# EAGLE schematic AVRProg (EAGLE 6.2)
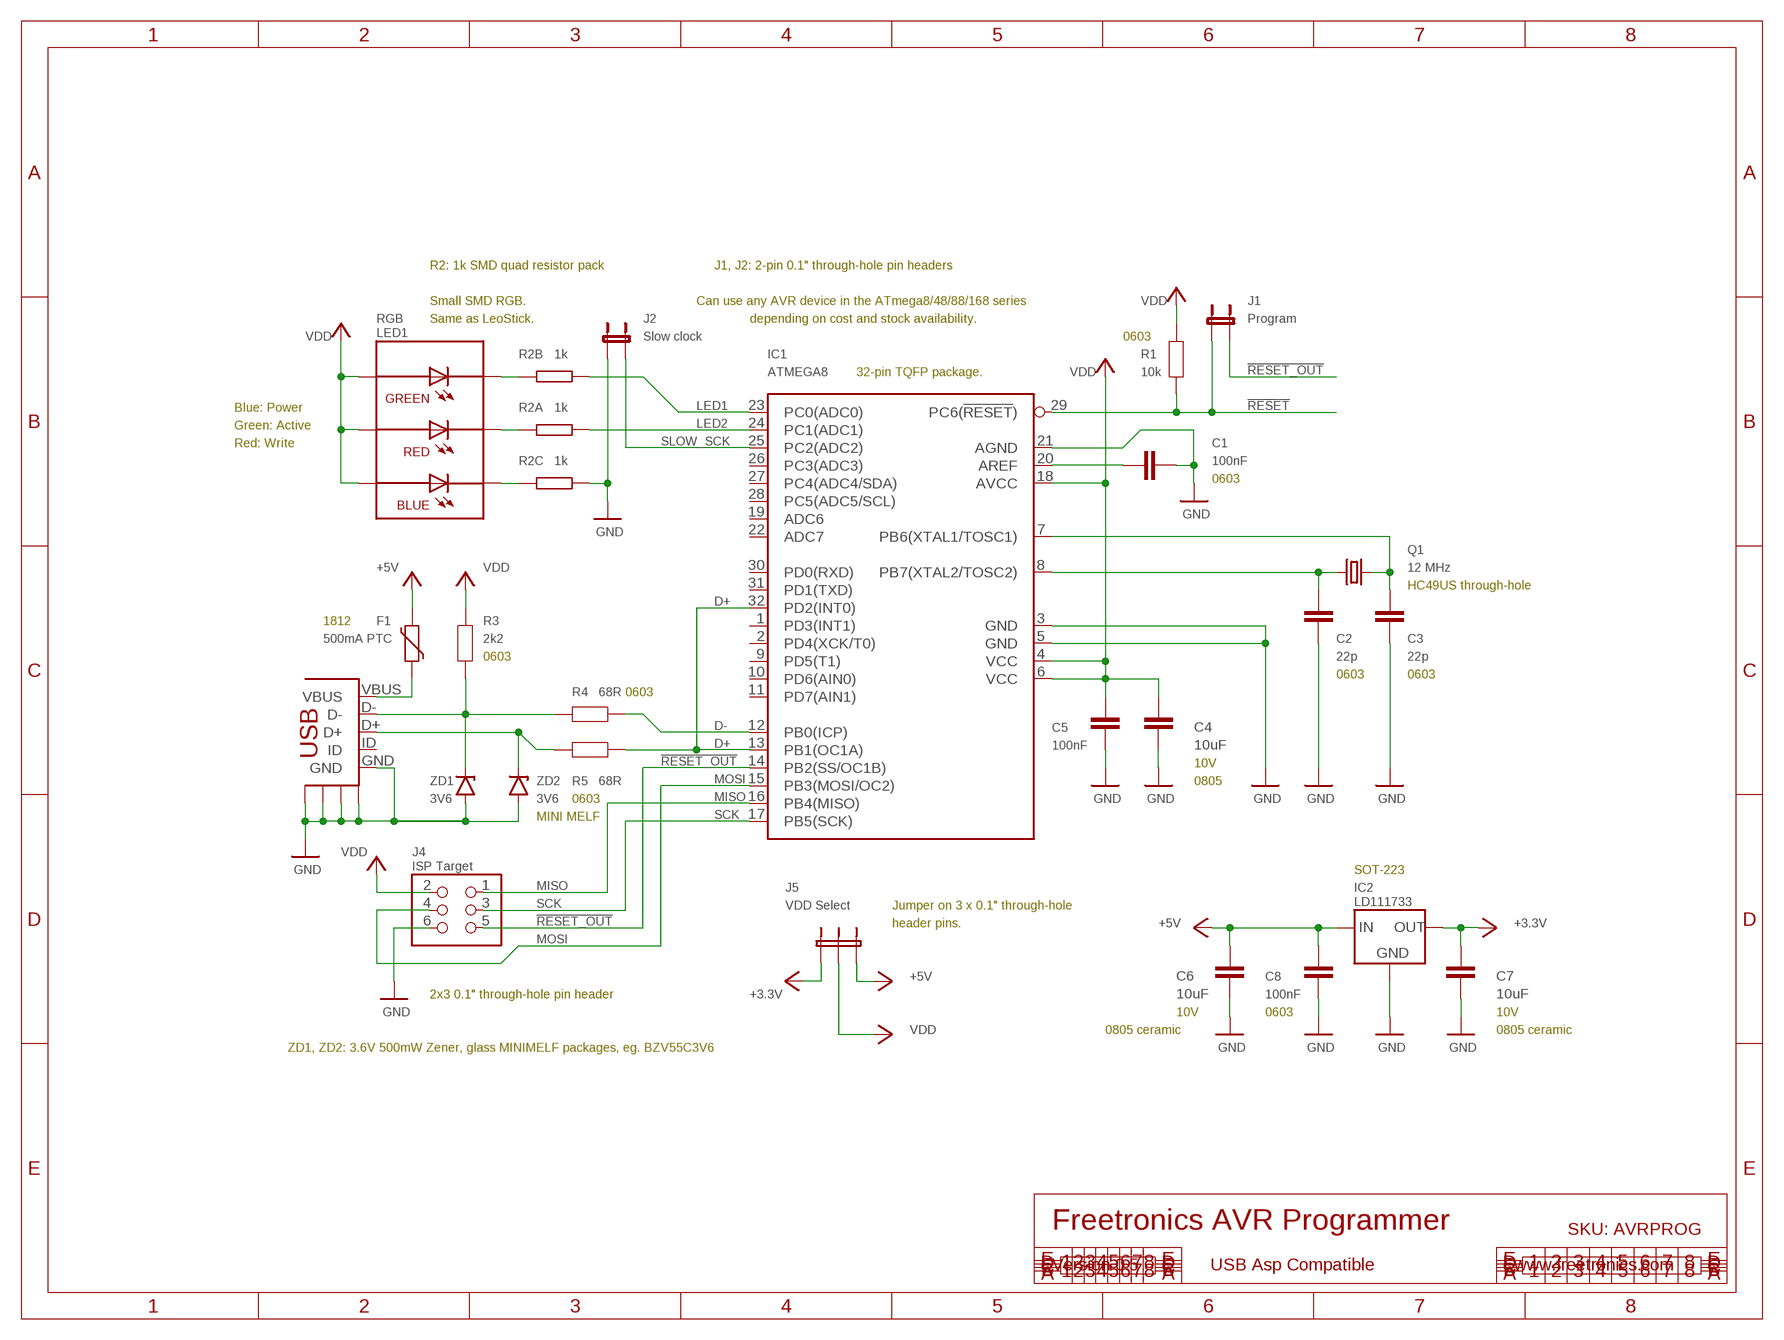
[diagram p0: schematic, sheet 1]

## Parts
C1  100nF  CAP0603  [0603]
C2  22p  CAP0603  [0603]
C3  22p  CAP0603  [0603]
C4  10uF  C-EUC0805  [C0805]
C5  100nF  CAP0603  [0603]
C6  10uF  C-EUC0805  [C0805]
C7  10uF  C-EUC0805  [C0805]
C8  100nF  CAP0603  [0603]
F1  500mA PTC  PTC  [1812]
IC1  ATMEGA8  ATMEGA168  [TQFP32-08]
IC2  LD111733  LD1117-FIXED  [SOT-223]
J1  Program  JUMPER_PTH  [HEADER_1X02]
J2  Slow clock  JUMPER_PTH  [HEADER_1X02]
J3  USB  USB-FT  [USB-MINIB-FT]
J4  ISP Target  HEADER_2X3  [HEADER_2X3]
J5  VDD Select  JUMPER_SPDT  [JUMPER_SPDT]
LED1  RGB  RGBLEDSMT  [19-337]
Q1  12 MHz  CRYSTALHC49US  [HC49US]
R1  10k  RESISTOR0603  [0603]
R2  1k  CAY16  [CAY16]
R3  2k2  RESISTOR0603  [0603]
R4  68R  RESISTOR0603  [0603]
R5  68R  RESISTOR0603  [0603]
ZD1  3V6  ZENERMINIMELF  [MINIMELF]
ZD2  3V6  ZENERMINIMELF  [MINIMELF]

## Nets
!RESET: IC1.29(PC6(!RESET!)) J1.1 R1.1
!RESET_OUT: IC1.14(PB2(SS/OC1B)) J1.2 J4.5
+3V3: C7.1 IC2.2(OUT) IC2.4(OUT) J5.1 ; supply symbol labelled +3.3V
+5V: C6.1 C8.1 F1.2 IC2.3(IN) J5.3
D+: IC1.13(PB1(OC1A)) IC1.32(PD2(INT0)) R5.1
D-: IC1.12(PB0(ICP)) R4.1
GND: C1.2 C2.1 C3.1 C4.2 C5.2 C6.2 C7.2 C8.2 IC1.3(GND) IC1.5(GND) IC1.21(AGND) IC2.1(GND) J2.1 J3.GND J3.SH1(SH$1) J3.SH2(SH$2) J3.SH3(SH$3) J3.SH4(SH$4) J4.6 R2.3 ZD1.A ZD2.A
LED1: IC1.23(PC0(ADC0)) R2.2
LED2: IC1.24(PC1(ADC1)) R2.1
MISO: IC1.16(PB4(MISO)) J4.1
MOSI: IC1.15(PB3(MOSI/OC2)) J4.4
N$1: LED1.1(C-B) R2.6
N$2: LED1.2(C-R) R2.8
N$3: LED1.3(C-G) R2.7
N$138: C3.2 IC1.7(PB6(XTAL1/TOSC1)) Q1.2
N$139: C2.2 IC1.8(PB7(XTAL2/TOSC2)) Q1.1
N$141: F1.1 J3.VBUS
N$142: C1.1 IC1.20(AREF)
N$143: J3.D+ R5.2 ZD2.K
N$144: J3.D- R3.1 R4.2 ZD1.K
SCK: IC1.17(PB5(SCK)) J4.3
SLOW_SCK: IC1.25(PC2(ADC2)) J2.2
VDD: C4.1 C5.1 IC1.4(VCC) IC1.6(VCC) IC1.18(AVCC) J4.2 J5.2 LED1.4(A-B) LED1.5(A-R) LED1.6(A-G) R1.2 R3.2
Unconnected: IC1.1(PD3(INT1)) IC1.2(PD4(XCK/T0)) IC1.9(PD5(T1)) IC1.10(PD6(AIN0)) IC1.11(PD7(AIN1)) IC1.19(ADC6) IC1.22(ADC7) IC1.26(PC3(ADC3)) IC1.27(PC4(ADC4/SDA)) IC1.28(PC5(ADC5/SCL)) IC1.30(PD0(RXD)) IC1.31(PD1(TXD)) J3.ID R2.4 R2.5

## Notes on the sheet
- R2: 1k SMD quad resistor pack | J1, J2: 2-pin 0.1" through-hole pin headers
- Small SMD RGB. | Can use any AVR device in the ATmega8/48/88/168 series
- Same as LeoStick. | depending on cost and stock availability.
- 0603
- 32-pin TQFP package.
- Blue: Power
- Green: Active
- Red: Write
- 0603
- HC49US through-hole
- 1812
- 0603
- 0603 | 0603
- 0603
- 10V
- 0805
- 0603
- MINI MELF
- SOT-223
- Jumper on 3 x 0.1" through-hole
- header pins.
- 2x3 0.1" through-hole pin header
- 10V | 0603 | 10V
- 0805 ceramic | 0805 ceramic
- ZD1, ZD2: 3.6V 500mW Zener, glass MINIMELF packages, eg. BZV55C3V6
- Freetronics AVR Programmer
- SKU: AVRPROG
- Version 0.5 | USB Asp Compatible | www.freetronics.com

## Library data of the parts
C1-C3 C5 C8 = freetronics-master-v1:CAP: Capacitor Standard 0603 ceramic capacitor, and 0.1" leaded capacitor.
C4 C6 C7 = freetronics-jon:C-EU: CAPACITOR, European symbol
F1 = freetronics-luke:PTC: Polymeric PTC ("Polyfuse")
IC1 = freetronics-luke:ATMEGA168
IC2 = freetronics-luke:LD1117-FIXED: Fixed-voltage LD1117 series LDOs in SOT-223 package. Note that the ground pin is labelled as ground, not as adj, because it's not the adjustable-voltage part.
J1 J2 = freetronics-luke:JUMPER_PTH: 2-pin (SPST) jumper header, 0.1" pitch through-hole.
J3 = freetronics-luke:USB-FT: 5-pin SMD USB mini-B. Same as Freetronics. (Turned off schematic pin labels on shield pins.)
J4 = freetronics-luke:HEADER_2X3: 6-pin (2x3) 0.1" male through-hole pin header.
J5 = freetronics-luke:JUMPER_SPDT: 3-pin (SPDT) jumper header, 0.1" pitch through-hole.
LED1 = freetronics-master-v1:RGBLED
Q1 = freetronics-master-v1:CRYSTAL: Crystals Various standard crystals. Proven footprints. Spark Fun Electronics SKU : COM-00534
R1 R3-R5 = freetronics-master-v1:RESISTOR: Resistor Basic schematic elements and footprints for 0603, 1206, and PTH 1/10th watt (small) resistors.
R2 = freetronics-luke:CAY16
ZD1 ZD2 = freetronics-luke:ZENER

## Net classes
0 default: width 0.152 mm, drill 0.241 mm, clearance 0.152 mm
1 POWER: width 0.305 mm